# Altium schematic sheet OptocouplerSchDoc.SchDoc
size A4; SheetNumber: 1; SheetTotal: 2
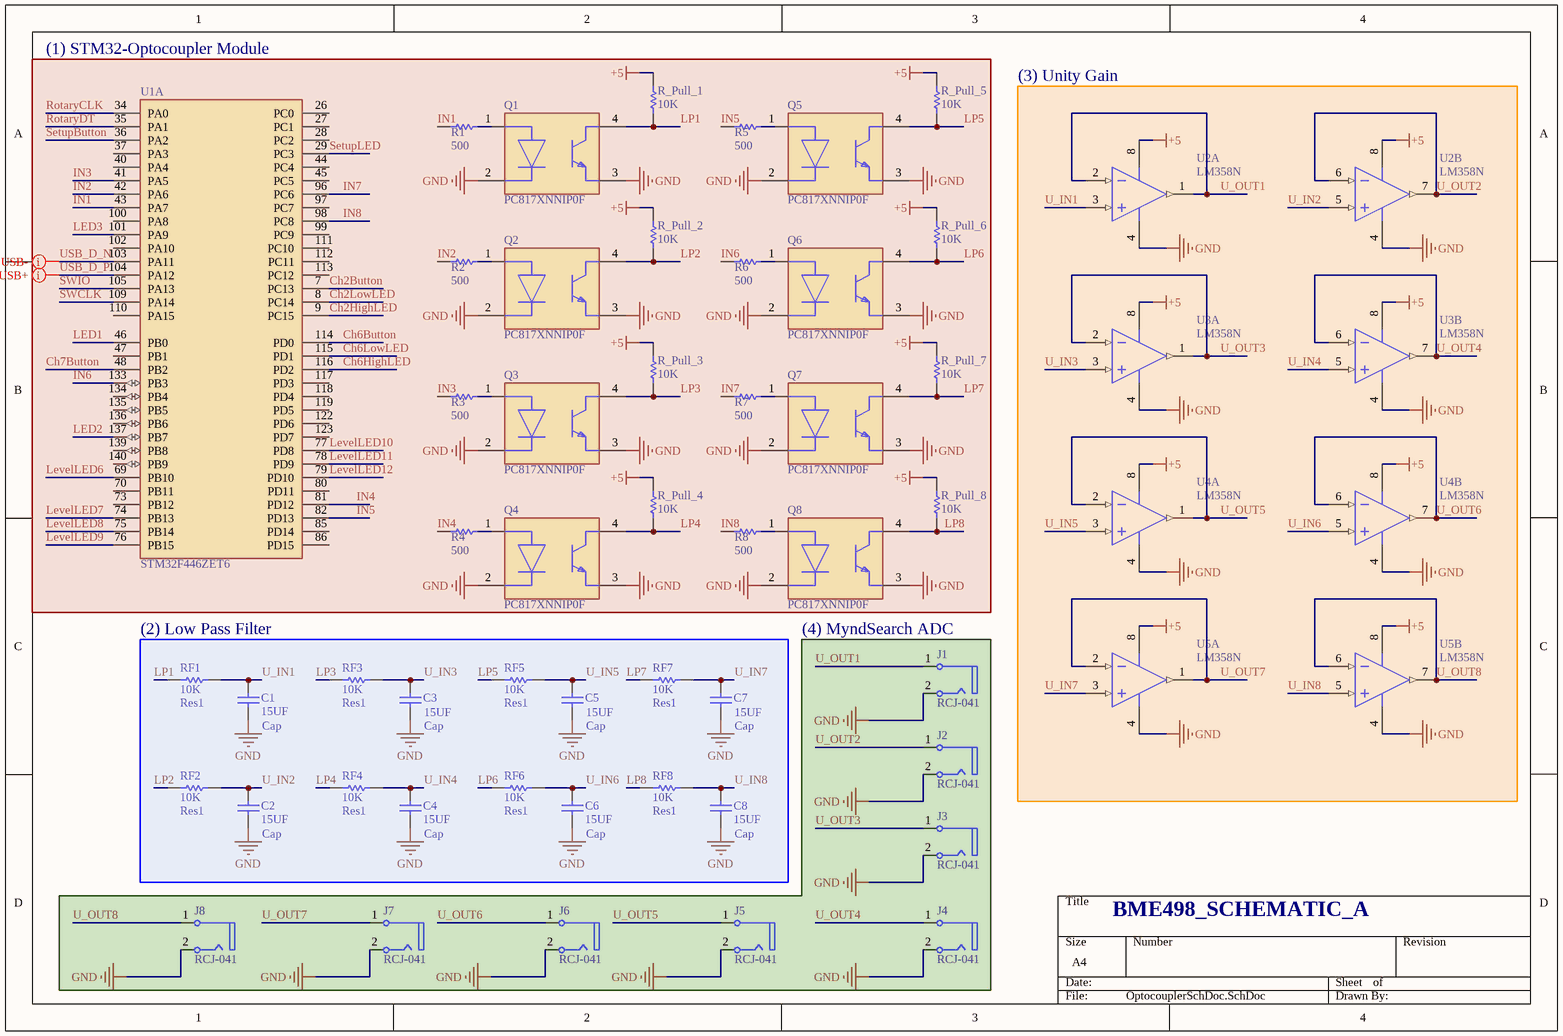
[diagram p0: OptocouplerSchDoc.SchDoc]

## Parts
C1  Cap  value 15UF  [RADIAL-0.1]
C2  Cap  value 15UF  [RADIAL-0.1]
C3  Cap  value 15UF  [RADIAL-0.1]
C4  Cap  value 15UF  [RADIAL-0.1]
C5  Cap  value 15UF  [RADIAL-0.1]
C6  Cap  value 15UF  [RADIAL-0.1]
C7  Cap  value 15UF  [RADIAL-0.1]
C8  Cap  value 15UF  [RADIAL-0.1]
J1  RCJ-041  [CUI-RCJ-041_V]
J2  RCJ-041  [CUI-RCJ-041_V]
J3  RCJ-041  [CUI-RCJ-041_V]
J4  RCJ-041  [CUI-RCJ-041_V]
J5  RCJ-041  [CUI-RCJ-041_V]
J6  RCJ-041  [CUI-RCJ-041_V]
J7  RCJ-041  [CUI-RCJ-041_V]
J8  RCJ-041  [CUI-RCJ-041_V]
Q1  PC817XNNIP0F  [FP-PC817XNNIP0F-MFG]
Q2  PC817XNNIP0F  [FP-PC817XNNIP0F-MFG]
Q3  PC817XNNIP0F  [FP-PC817XNNIP0F-MFG]
Q4  PC817XNNIP0F  [FP-PC817XNNIP0F-MFG]
Q5  PC817XNNIP0F  [FP-PC817XNNIP0F-MFG]
Q6  PC817XNNIP0F  [FP-PC817XNNIP0F-MFG]
Q7  PC817XNNIP0F  [FP-PC817XNNIP0F-MFG]
Q8  PC817XNNIP0F  [FP-PC817XNNIP0F-MFG]
R1  500  [RESC2013X60X35ML10T20]
R2  500  [RESC2013X60X35ML10T20]
R3  500  [RESC2013X60X35ML10T20]
R4  500  [RESC2013X60X35ML10T20]
R5  500  [RESC2013X60X35ML10T20]
R6  500  [RESC2013X60X35ML10T20]
R7  500  [RESC2013X60X35ML10T20]
R8  500  [RESC2013X60X35ML10T20]
R_Pull_1  10K  [RESC2013X60X35ML10T20]
R_Pull_2  10K  [RESC2013X60X35ML10T20]
R_Pull_3  10K  [RESC2013X60X35ML10T20]
R_Pull_4  10K  [RESC2013X60X35ML10T20]
R_Pull_5  10K  [RESC2013X60X35ML10T20]
R_Pull_6  10K  [RESC2013X60X35ML10T20]
R_Pull_7  10K  [RESC2013X60X35ML10T20]
R_Pull_8  10K  [RESC2013X60X35ML10T20]
RF1  Res1  value 10K  [AXIAL-0.3]
RF2  Res1  value 10K  [AXIAL-0.3]
RF3  Res1  value 10K  [AXIAL-0.3]
RF4  Res1  value 10K  [AXIAL-0.3]
RF5  Res1  value 10K  [AXIAL-0.3]
RF6  Res1  value 10K  [AXIAL-0.3]
RF7  Res1  value 10K  [AXIAL-0.3]
RF8  Res1  value 10K  [AXIAL-0.3]
U1  STM32F446ZET6  [FP-STM32F446ZET6-MFG]  (part A of 3)
U2  LM358N  [ONSC-PDIP-8-626-05_M]  (parts A,B of 2)
U3  LM358N  [ONSC-PDIP-8-626-05_M]  (parts A,B of 2)
U4  LM358N  [ONSC-PDIP-8-626-05_M]  (parts A,B of 2)
U5  LM358N  [ONSC-PDIP-8-626-05_M]  (parts A,B of 2)

## Blocks framed on the sheet
(1) STM32-Optocoupler Module: Q1-Q8 R1-R8 R_Pull_1-R_Pull_8 U1
(3) Unity Gain: U2-U5
(2) Low Pass Filter: C1-C8 RF1-RF8

## Nets
+5: R_Pull_1.2 R_Pull_2.2 R_Pull_3.2 R_Pull_4.2 R_Pull_5.2 R_Pull_6.2 R_Pull_7.2 R_Pull_8.2 U2.8(VCC) U3.8(VCC) U4.8(VCC) U5.8(VCC)
GND: C1.1 C2.1 C3.1 C4.1 C5.1 C6.1 C7.1 C8.1 J1.2 J2.2 J3.2 J4.2 J5.2 J6.2 J7.2 J8.2 Q1.2(C) Q1.3(E) Q2.2(C) Q2.3(E) Q3.2(C) Q3.3(E) Q4.2(C) Q4.3(E) Q5.2(C) Q5.3(E) Q6.2(C) Q6.3(E) Q7.2(C) Q7.3(E) Q8.2(C) Q8.3(E) U2.4(VEE/GND) U3.4(VEE/GND) U4.4(VEE/GND) U5.4(VEE/GND)
Ch2Button: U1.7(PC13)
Ch2HighLED: U1.9(PC15)
Ch2LowLED: U1.8(PC14)
Ch6Button: U1.114(PD0)
Ch6HighLED: U1.116(PD2)
Ch6LowLED: U1.115(PD1)
Ch7Button: U1.48(PB2)
IN1: R1.1 U1.43(PA7)
IN2: R2.1 U1.42(PA6)
IN3: R3.1 U1.41(PA5)
IN4: R4.1 U1.81(PD12)
IN5: R5.1 U1.82(PD13)
IN6: R6.1 U1.133(PB3)
IN7: R7.1 U1.96(PC6)
IN8: R8.1 U1.98(PC8)
LED1: U1.46(PB0)
LED2: U1.137(PB7)
LED3: U1.101(PA9)
LevelLED6: U1.69(PB10)
LevelLED7: U1.74(PB13)
LevelLED8: U1.75(PB14)
LevelLED9: U1.76(PB15)
LevelLED10: U1.77(PD8)
LevelLED11: U1.78(PD9)
LevelLED12: U1.79(PD10)
LP1: Q1.4(C) R_Pull_1.1 RF1.1
LP2: Q2.4(C) R_Pull_2.1 RF2.1
LP3: Q3.4(C) R_Pull_3.1 RF3.1
LP4: Q4.4(C) R_Pull_4.1 RF4.1
LP5: Q5.4(C) R_Pull_5.1 RF5.1
LP6: Q6.4(C) R_Pull_6.1 RF6.1
LP7: Q7.4(C) R_Pull_7.1 RF7.1
LP8: Q8.4(C) R_Pull_8.1 RF8.1
RotaryCLK: U1.34(PA0)
RotaryDT: U1.35(PA1)
SetupButton: U1.36(PA2)
SetupLED: U1.29(PC3)
SWCLK: U1.109(PA14)
SWIO: U1.105(PA13)
U_IN1: C1.2 RF1.2 U2.3(INA+)
U_IN2: C2.2 RF2.2 U2.5(INB+)
U_IN3: C3.2 RF3.2 U3.3(INA+)
U_IN4: C4.2 RF4.2 U3.5(INB+)
U_IN5: C5.2 RF5.2 U4.3(INA+)
U_IN6: C6.2 RF6.2 U4.5(INB+)
U_IN7: C7.2 RF7.2 U5.3(INA+)
U_IN8: C8.2 RF8.2 U5.5(INB+)
U_OUT1: J1.1 U2.1(OUTA) U2.2(INA-)
U_OUT2: J2.1 U2.6(INB-) U2.7(OUTB)
U_OUT3: J3.1 U3.1(OUTA) U3.2(INA-)
U_OUT4: J4.1 U3.6(INB-) U3.7(OUTB)
U_OUT5: J5.1 U4.1(OUTA) U4.2(INA-)
U_OUT6: J6.1 U4.6(INB-) U4.7(OUTB)
U_OUT7: J7.1 U5.1(OUTA) U5.2(INA-)
U_OUT8: J8.1 U5.6(INB-) U5.7(OUTB)
USB_D_N: U1.103(PA11)
USB_D_P: U1.104(PA12)
NetQ1_1: Q1.1(A) R1.2
NetQ2_1: Q2.1(A) R2.2
NetQ3_1: Q3.1(A) R3.2
NetQ4_1: Q4.1(A) R4.2
NetQ5_1: Q5.1(A) R5.2
NetQ6_1: Q6.1(A) R6.2
NetQ7_1: Q7.1(A) R7.2
NetQ8_1: Q8.1(A) R8.2

Not connected (* = marked no-connect by the designer): U1 26(PC0) 27(PC1) 28(PC2) 37(PA3) 40(PA4) 44(PC4) 45(PC5) 47(PB1) 70(PB11) 73(PB12) 80(PD11) 85(PD14) 86(PD15) 97(PC7) 99(PC9) 100(PA8) 102(PA10) 110(PA15) 111(PC10) 112(PC11) 113(PC12) 117(PD3) 118(PD4) 119(PD5) 122(PD6) 123(PD7) 134(PB4) 135(PB5) 136(PB6) 139(PB8) 140(PB9)

## Layout directives
differential pair: USB_D_N, USB_D_P

## Notes on the sheet
- (4) MyndSearch ADC
- BME498_SCHEMATIC_A

## Library data of the parts
C1-C8 = CAP ALUM 15UF 20% 16V RADIAL: Capacitor; Manufacturer Part Number: EEA-GA1C150B; Voltage Rating: 16V; Published: 8-Jun-2000; LatestRevisionDate: 17-Jul-2002; LatestRevisionNote: Re-released for DXP Platform.; Publisher: Altium Limited
J1-J8 = CMP-1692-00002-1: Female RCJ Jack, 2 Position, Height 11.724 mm, Tail Length 4 mm, RoHS, Bulk; Case\Package: Metal; Connector Type: HDMI; Current Rating: 500 mA; Voltage Rating: 40 V; Length: 16.2 mm; Pins: 19; ComponentLink1URL: http://www.cui.com/; ComponentLink1Description: Manufacturer URL; Packaging: Tape and Reel; Lead Pitch: 0.5 mm; PackageDescription: Female RCJ Jack, 2 Position, Height 11.724 mm, Tail Length 4 mm; RoHSCompliant: true; Min Operating Temperature: -55 degC; Height: 6.1 mm; Contact Material: Copper; REACH SVHC: No SVHC; DatasheetVersion: Rev. B, 02/2012; ComponentLink2Description: Datasheet; Contact Plating: Gold; Colour: Black; Max Operating Temperature: 85 degC; Mount: Surface Mount; Package Quantity: 400; Gender: Female; ComponentLink2URL: http://www.cui.com/product/resource/rcj-04x.pdf; PackageReference: RCJ-041
Q1-Q8 = CMP-65434-000005-1: OPTOISOLATOR 5KV TRANS 4SMD; Reverse Breakdown Voltage: 6V; Output Current per Channel: 30mA; Power Dissipation: 200mW; Collector-emitter Voltage-Max: 200mV; Max Output Voltage: 80V; Input Current: 50mA; Forward Voltage: 1.4V; Fall Time: 18000ns; Number of Elements: 1; Input Type: DC; Packaging: Tape and Reel; RoHS Compliant: Yes; Contact Plating: Copper; Min Operating Temperature: -30°C; Collector Emitter Saturation Voltage: 200mV; Max Input Current: 50mA; Radiation Hardening: No; Max Collector Current: 50mA; Case/Package: SMD/SMT; Mount: Surface Mount; Output Voltage: 80V; Forward Current: 50mA; Max Power Dissipation: 200mW; Collector Emitter Voltage (VCEO): 80V; Number of Channels: 1; Rise Time: 18000ns; Isolation Voltage: 5kV; Number of Pins: 4; Lead Free: Lead Free; Package Quantity: 2000; Isolation Voltage-Max: 5kV; Max Operating Temperature: 100°C
R1-R8 = CMP-2100-03671-1: Chip Resistor, 1 KOhm, +/- 1%, 125 mW, -55 to 155 degC, 0805 (2012 Metric), RoHS, Tape and Reel; Manufacturer: Yageo; Temperature Coefficient: 100ppm/degreesC; Voltage Rating (DC): 150V; Max Power Dissipation: 125mW; Resistance: 500Ohm; Number of Pins: 2; Number of Terminations: 2; Datasheet URL: http://www.yageo.com/NewPortal/yageodocoutput?fileName=/pdf/R-Chip/PYu-RC_Group_51_RoHS_L_5.pdf; Length: 0.079inch; Package Description: 2-Pin Surface Mounted Device, Body 2 x 1.25 mm; Depth: 1.25mm; Height: 0.024inch; Military Standard: Not; Case/Package: 0805; Package Reference: 0805; RoHSCompliant: true; Lead Free: LeadFree; Packaging: TapeandReel; Package Quantity: 1; Datasheet Version: Rev. 5, 10/2016; Tolerance: 1%; Min Operating Temperature: -55degC; Voltage Rating: 150V; Composition: ThickFilm; Case Code (Imperial): 0805; Power Rating: 125mW; Width: 0.049inch; Case Code (Metric): 2012; Manufacturer URL: http://www.yageo.com/; Max Operating Temperature: 155degC; REACH SVHC: Unknown; Termination: SMD/SMT
R_Pull_1-R_Pull_8 = CMP-2100-03671-1: Chip Resistor, 1 KOhm, +/- 1%, 125 mW, -55 to 155 degC, 0805 (2012 Metric), RoHS, Tape and Reel; Manufacturer: Yageo; Temperature Coefficient: 100ppm/degreesC; Voltage Rating (DC): 150V; Max Power Dissipation: 125mW; Resistance: 10KOhm; Number of Pins: 2; Number of Terminations: 2; Datasheet URL: http://www.yageo.com/NewPortal/yageodocoutput?fileName=/pdf/R-Chip/PYu-RC_Group_51_RoHS_L_5.pdf; Length: 0.079inch; Package Description: 2-Pin Surface Mounted Device, Body 2 x 1.25 mm; Depth: 1.25mm; Height: 0.024inch; Military Standard: Not; Case/Package: 0805; Package Reference: 0805; RoHSCompliant: true; Lead Free: LeadFree; Packaging: TapeandReel; Package Quantity: 1; Datasheet Version: Rev. 5, 10/2016; Tolerance: 1%; Min Operating Temperature: -55degC; Voltage Rating: 150V; Composition: ThickFilm; Case Code (Imperial): 0805; Power Rating: 125mW; Width: 0.049inch; Case Code (Metric): 2012; Manufacturer URL: http://www.yageo.com/; Max Operating Temperature: 155degC; REACH SVHC: Unknown; Termination: SMD/SMT
RF1-RF8 = RES 10K OHM 5% 1/4W AXIAL: Resistor; Manufacturer Part Number: CFR-25JB-52-10K; Designator: R?; Power Rating: 1/4W; Tolerance: 0.05; Published: 8-Jun-2000; LatestRevisionDate: 17-Jul-2002; LatestRevisionNote: Re-released for DXP Platform.; Publisher: Altium Limited
U1 = CMP-12105-000067-1: IC MCU 32BIT 512KB FLASH 144LQFP; Manufacturer: STMicroelectronics; Standoff Height: 0.05mm; Memory Size: 512KBytes; Data Bus Width: 32bits; Number Of Timers/Counters: 14; Number Of I2C Channels: 4; Number Of Usb Channels: 2; Frequency: 180MHz; Ram Size: 128KBytes; Number Of I/Os: 114; Min Supply Voltage: 1.7V; Max Junction Temp: +105°C; Number Of Cores: 1; Core Architecture: Arm Cortex-M4; Max Supply Voltage: 3.6V; Number Of Adc Channels: 24; Number Of Pwm Channels: 32; Number Of Uart Channels: 6; Number Of A/D Converters: 3; Interface: I2C,SPI,UART,USART,EBI/EMI,CAN,USB,LIN,IrDA,I2S,SMBus,Other; Mouser Description: 32 Bit Microcontroller, High Performance, Arm Cortex-M4, 180 Mhz, 512 Kb, 128 Kb, 144, Lqfp; Temperature Range High: +105°C; Device Class L3: Microcontrollers; Ambient Temperature Range High: +85°C; Lead Free: Yes; Octopart: https://octopart.com/stm32f446zet6-stmicroelectronics-52642927; Device Class L2: Embedded Processors and Controllers; Height: 1.6mm; Category: IC; Manufacturer Part Number: STM32F446ZET6; RoHS: TRUE; Memory Type: FLASH; Temperature: -40°C to +105°C; Number Of Spi Channels: 4; Device Class L1: Integrated Circuits (ICs); Package: LQFP144; Digikey Description: IC MCU 32BIT 512KB FLASH 144LQFP; Automotive: No; ComponentLink2Description: Datasheet; ComponentLink2URL: https://www.st.com/content/ccc/resource/technical/document/datasheet/65/cb/75/50/53/d6/48/24/DM00141306.pdf/files/DM00141306.pdf/jcr:content/translations/en.DM00141306.pdf; Ambient Temperature Range Low: -40°C; Temperature Range Low: -40°C
U2-U5 = CMP-1310-00098-1: Single Supply Dual Operational Amplifier, 3 to 32 V, 0 to 70 degC, 8-Pin PDIP, Tube; Manufacturer: On Semiconductor; VCC Max (V): 32; VCC Min (V): 3; Mounting Technology: Through Hole; ComponentLink3Description: Package Specification; ComponentLink3URL: http://www.onsemi.com/pub_link/Collateral/LM211-D.PDF; RoHS: FALSE; Packing: Tube; PackageDescription: 8-Pin Plastic Dual-In Line Package, Body 9.52 x 6.605 mm, Pitch 2.54 mm; PackageReference: PDIP-8-626-05; PackageVersion: Rev. M, 04/2010; PartNumber: LM358N; ComponentLink2Description: Datasheet; ComponentLink2URL: http://www.onsemi.cn/pub_link/Collateral/LM358-D.PDF; ComponentLink1URL: http://www.onsemi.com/; ComponentLink1Description: Manufacturer URL; DatasheetVersion: Rev. 27